# Altium schematic sheet 08_SLAVE_CARD_CONNECTOR_RJ45.SchDoc
size A3
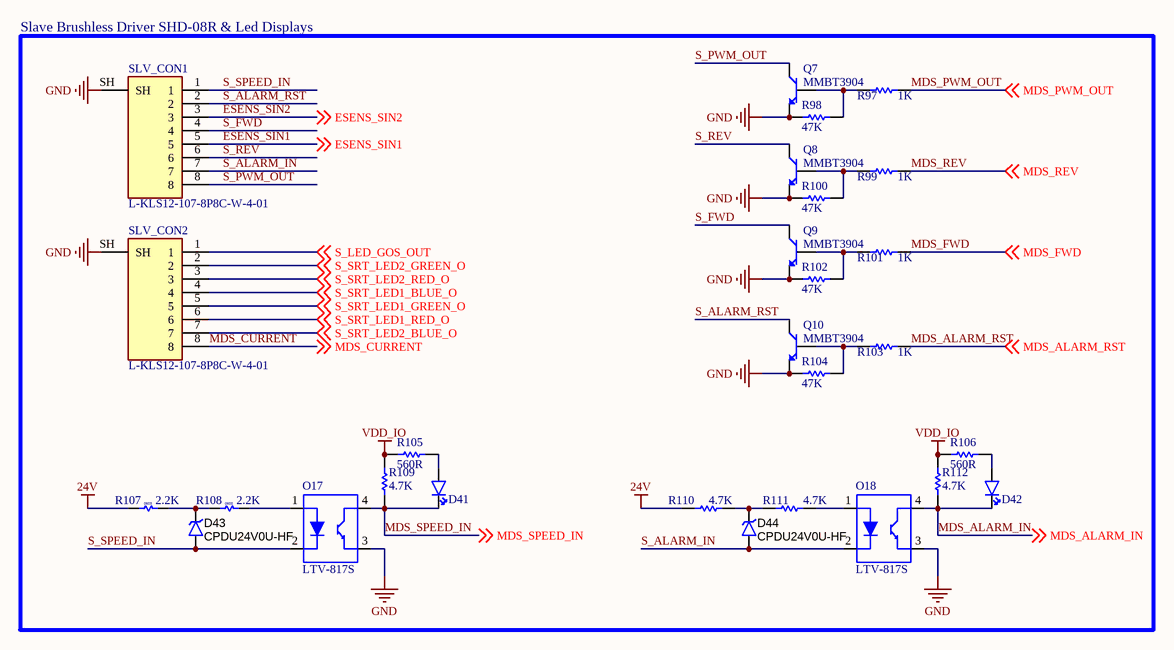
[diagram p0: 08_SLAVE_CARD_CONNECTOR_RJ45.SchDoc]

## Parts
D41  led_green  [805LED]  (value not drawn)
D42  led_green  [805LED]  (value not drawn)
D43  CPDU24V0U-HF  [SOD523F]
D44  CPDU24V0U-HF  [SOD523F]
O17  LTV-817S  [SMD4-2.54-4.6X6.5MM]
O18  LTV-817S  [SMD4-2.54-4.6X6.5MM]
Q7  MMBT3904  [ONSC-SOT-23-3-318-08_V]
Q8  MMBT3904  [ONSC-SOT-23-3-318-08_V]
Q9  MMBT3904  [ONSC-SOT-23-3-318-08_V]
Q10  MMBT3904  [ONSC-SOT-23-3-318-08_V]
R97  1K  [603R]
R98  47K  [603R]
R99  1K  [603R]
R100  47K  [603R]
R101  1K  [603R]
R102  47K  [603R]
R103  1K  [603R]
R104  47K  [603R]
R105  560R  [603R]
R106  560R  [603R]
R107  2.2K  [603R]
R108  2.2K  [603R]
R109  4.7K  [603R]
R110  4.7K  [603R]
R111  4.7K  [603R]
R112  4.7K  [603R]
SLV_CON1  L-KLS12-107-8P8C-W-4-01  [RJ45_JACK_H L-KLS12-107-8P8C-W-4-01]
SLV_CON2  L-KLS12-107-8P8C-W-4-01  [RJ45_JACK_H L-KLS12-107-8P8C-W-4-01]

## Blocks framed on the sheet
Slave Brushless Driver SHD-08R & Led Displays: D41-D44 O17 O18 Q7-Q10 R97-R112 SLV_CON1 SLV_CON2

## Nets
24V: R107.1 R110.1
GND: O17.3(EMITER) O18.3(EMITER) Q7.2(E) Q8.2(E) Q9.2(E) Q10.2(E) R98.1 R100.1 R102.1 R104.1 SLV_CON1.SH SLV_CON2.SH
VDD_IO: R105.2 R106.2 R109.2 R112.2
ESENS_SIN1: SLV_CON1.5 ; off-sheet ESENS_SIN1
ESENS_SIN2: SLV_CON1.3 ; off-sheet ESENS_SIN2
MDS_ALARM_IN: D42.2(K) O18.4(COLLECTOR) R112.1 ; off-sheet MDS_ALARM_IN
MDS_ALARM_RST: R103.2 ; off-sheet MDS_ALARM_RST
MDS_CURRENT: SLV_CON2.8 ; off-sheet MDS_CURRENT
MDS_FWD: R101.2 ; off-sheet MDS_FWD
MDS_PWM_OUT: R97.2 ; off-sheet MDS_PWM_OUT
MDS_REV: R99.2 ; off-sheet MDS_REV
MDS_SPEED_IN: D41.2(K) O17.4(COLLECTOR) R109.1 ; off-sheet MDS_SPEED_IN
S_ALARM_IN: D44.1 O18.2(CATHODE) SLV_CON1.7
S_ALARM_RST: Q10.3(C) SLV_CON1.2
S_FWD: Q9.3(C) SLV_CON1.4
S_LED_GOS_OUT: SLV_CON2.1 ; off-sheet S_LED_GOS_OUT
S_PWM_OUT: Q7.3(C) SLV_CON1.8
S_REV: Q8.3(C) SLV_CON1.6
S_SPEED_IN: D43.1 O17.2(CATHODE) SLV_CON1.1
S_SRT_LED1_BLUE_O: SLV_CON2.4 ; off-sheet S_SRT_LED1_BLUE_O
S_SRT_LED1_GREEN_O: SLV_CON2.5 ; off-sheet S_SRT_LED1_GREEN_O
S_SRT_LED1_RED_O: SLV_CON2.6 ; off-sheet S_SRT_LED1_RED_O
S_SRT_LED2_BLUE_O: SLV_CON2.7 ; off-sheet S_SRT_LED2_BLUE_O
S_SRT_LED2_GREEN_O: SLV_CON2.2 ; off-sheet S_SRT_LED2_GREEN_O
S_SRT_LED2_RED_O: SLV_CON2.3 ; off-sheet S_SRT_LED2_RED_O
NetD41_1: D41.1(A) R105.1
NetD42_1: D42.1(A) R106.1
NetD43_2: D43.2 R107.2 R108.1
NetD44_2: D44.2 R110.2 R111.1
NetO17_1: O17.1(ANODE) R108.2
NetO18_1: O18.1(ANODE) R111.2
NetQ7_1: Q7.1(B) R97.1 R98.2
NetQ8_1: Q8.1(B) R99.1 R100.2
NetQ9_1: Q9.1(B) R101.1 R102.2
NetQ10_1: Q10.1(B) R103.1 R104.2

## Notes on the sheet
- (in symbol RES 2.2K OHM 5% 1/10W 0603) 0603

## Library data of the parts
D41 D42 = LED_GREEN_0805: LED 2X1.2MM 570NM GN WTR CLR SMD; Millicandela Rating: 50mcd; Voltage - Forward (Vf): 2.1V; value: led_green; Digi-Key Part Number: 754-1127-1-ND; Case: 0805; Viewing Angle: -
D43 D44 = TVS DIODE 24VWM 50V 0603/SOD523F CPDU24V0U-HF: 50V Clamp 3A (8/20µs) Ipp Tvs Diode Surface Mount 0603/SOD-523F; Manufacturer: Comchip Technology; Type: Zener; Voltage - Reverse Standoff (Typ): 24V (Max); Voltage - Breakdown (Min): 26.5V; Power - Peak Pulse: 150W; Power Line Protection: No; Unidirectional Channels: 1; Digi-Key Part Number: 641-1679-1-ND; Manufacturer Part Number: CPDU24V0U-HF; Voltage - Clamping (Max) @ Ipp: 50V; Operating Temperature: -55°C ~ 125°C (TJ); Package / Case: 0603/SOD-523F; Value: CPDU24V0U-HF
O17 O18 = OPTOISOLATR 5KV TRANSISTOR 4-SMD LTV-817S: Optoisolator Transistor Output 5000Vrms 1 Channel 4-SMD; Voltage - Output (Max): 35V; Number of Channels: 1; Rise / Fall Time (Typ): 4µs, 3µs; Current - DC Forward (If) (Max): 50 mA; Voltage - Forward (Vf) (Typ): 1.2V; Output Type: Transistor; Voltage - Isolation: 5000Vrms; Package / Case: 4-SMD, Gull Wing; Operating Temperature: -30°C ~ 110°C; Value: LTV-817S; Digi-Key Part Number: 160-1367-5-ND
Q7-Q10 = NPN_BT3904: Bipolar (BJT) Transistor NPN 40V 200mA 300MHz 300mW Surface Mount SOT-23-3 (TO-236); Manufacturer: ON Semiconductor; Manufacturer Part Number: MMBT3904LT3G; MAX  Voltage / Current: 40V /200mA; DC Current Gain (hFE) (Min) @ Ic, Vce: 100 @ 10mA, 1V; Vce Saturation (Max) @ Ib, Ic: 300mV @ 5mA, 50mA; value: MMBT3904; Digi-Key Part Number: MMBT3904LT3GOSTR-ND; Package / Case: TO-236-3, SC-59, SOT-23-3; Power - Max: 300mW; Frequency - Transition: 300MHz; Transistor Type: NPN; Current - Collector (Ic) (Max): 200mA; Voltage - Collector Emitter Breakdown (Max): 40V; Operating Temperature: -55°C ~ 150°C (TJ); Supplier Device Package: SOT-23-3 (TO-236)
R97 R99 R101 R103 = RES_1K_OHM_%5_0.1W_0603: 1 kOhms ±5% 0.1W, 1/10W Chip Resistor 0603 (1608 Metric) Moisture Resistant Thick Film; Manufacturer: Yageo; Manufacturer Part Number: RC0603JR-071KL; Temperature Coefficient: ±100ppm/°C; Value: 1K; Digi-Key Part Number: 311-1.0KGRTR-ND; Tolerance: ±5%; Power (Watts): 0.1W, 1/10W; Composition: Thick Film; Operating Temperature: -55°C ~ 155°C; Package / Case: 0603 (1608 Metric); Size / Dimension: 0.063" L x 0.032" W (1.60mm x 0.80mm); Height - Seated (Max): 0.022" (0.55mm); Features: Moisture Resistant
R98 R100 R102 R104 = RES_47K_OHM_%5_0.1W_0603: 47 kOhms ±5% 0.1W, 1/10W Chip Resistor 0603 (1608 Metric) Moisture Resistant Thick Film; Manufacturer: Yageo; Manufacturer Part Number: RC0603JR-0747KL; Temperature Coefficient: ±100ppm/°C; Value: 47K; Digi-Key Part Number: 311-47KGRTR-ND; Tolerance: ±5%; Power (Watts): 0.1W, 1/10W; Composition: Thick Film; Operating Temperature: -55°C ~ 155°C; Package / Case: 0603 (1608 Metric); Size / Dimension: 0.063" L x 0.032" W (1.60mm x 0.80mm); Height - Seated (Max): 0.022" (0.55mm); Features: Moisture Resistant
R105 R106 = RES_560_OHM_%5_0.1W_0603: 560 Ohms ±5% 0.1W, 1/10W Chip Resistor 0603 (1608 Metric) Moisture Resistant Thick Film; Manufacturer: Yageo; Manufacturer Part Number: RC0603JR-07560RL; Temperature Coefficient: ±100ppm/°C; Value: 560R; Digi-Key Part Number: 311-560GRCT-ND; Tolerance: ±5%; Power (Watts): 0.1W, 1/10W; Composition: Thick Film; Operating Temperature: -55°C ~ 155°C; Package / Case: 0603 (1608 Metric); Size / Dimension: 0.063" L x 0.032" W (1.60mm x 0.80mm); Height - Seated (Max): 0.022" (0.55mm); Features: Moisture Resistant
R107 R108 = RES 2.2K OHM 5% 1/10W 0603: 2.2 kOhms ±5% 0.1W, 1/10W Chip Resistor 0603 (1608 Metric) Automotive AEC-Q200 Thick Film; Temperature Coefficient: ±200ppm/°C; Value: 2.2K; Digi-Key Part Number: RMCF0603JT2K20TR-ND; Tolerance: ±5%; Power (Watts): 0.1W, 1/10W; Operating Temperature: -55°C ~ 155°C; Package / Case: 0603 (1608 Metric)
R109-R112 = RES_4.7K_OHM_%5_0.1W_0603: 4.7 kOhms ±5% 0.1W, 1/10W Chip Resistor 0603 (1608 Metric) Moisture Resistant Thick Film; Manufacturer: Yageo; Manufacturer Part Number: RC0603JR-074K7L; Temperature Coefficient: ±100ppm/°C; Value: 4.7K; Digi-Key Part Number: 311-4.7KGRTR-ND; Tolerance: ±5%; Power (Watts): 0.1W, 1/10W; Composition: Thick Film; Operating Temperature: -55°C ~ 155°C; Package / Case: 0603 (1608 Metric); Size / Dimension: 0.063" L x 0.032" W (1.60mm x 0.80mm); Height - Seated (Max): 0.022" (0.55mm); Features: Moisture Resistant
SLV_CON1 SLV_CON2 = MODULAR JACK THT R/A 8P8C (RJ45,Ethernet) BLACK L-KLS12-107-8P8C-W-4-01: Jack Modular Connector 8p8c (RJ45, Ethernet) 90° Angle (Right) Shielded; Digi-Key Part Number: https://ozdisan.com/konnektor-ve-baglanti-elemanlari/moduler-konnektorler/moduler-jackler/L-KLS12-107-8P8C-W-4-01/507086; Value: L-KLS12-107-8P8C-W-4-01; Number of Positions/Contacts: 8P8C; Orientation: 90° Angle  (Right); Shielding: Shielded